# EAGLE schematic power (EAGLE 9.6.1)
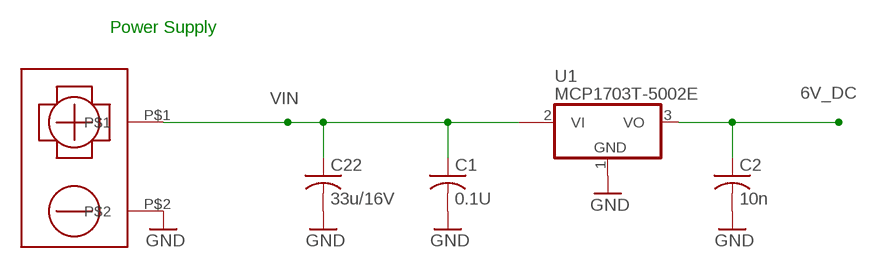
[diagram p0: schematic, sheet 1]

## Parts
C1  0.1U  C-USC0805  [C0805]
C2  10n  C-USC0805  [C0805]
C22  33u/16V  C-USC0805  [C0805]
U1  MCP1703T-5002E  MCP170312MB  [SOT89]
U$1  9V_968  [9V_968]

## Nets
6V_DC: C2.1 U1.3(VO)
GND: C1.2 C2.2 C22.2 U1.1(GND) U$1.P$2
VIN: C1.1 C22.1 U1.2@1(VI1) U$1.P$1
Unconnected: U1.2(VI)

## Notes on the sheet
- Power Supply

## Library data of the parts
C1 C2 C22 = adafruit:C-US: CAPACITOR, American symbol
U1 = linear:MCP1703*: 250 mA, 16V, Low Quiescent Current LDO Regulator Source: http://ww1.microchip.com/downloads/en/DeviceDoc/22049b.pdf
U$1 = zort2:9V_968: Keystone 968, 9V connector pad. https://www.digikey.com/product-detail/en/keystone-electronics/968/36-968-ND/151577